# Altium schematic sheet 09_SARADC_OTP.SchDoc: =title
size A3; Organization: 六零加智能科技; Address4: www.nidone.com.cn; DocumentNumber: kang jin; Revision: 1.0; SheetNumber: 9; SheetTotal: 23
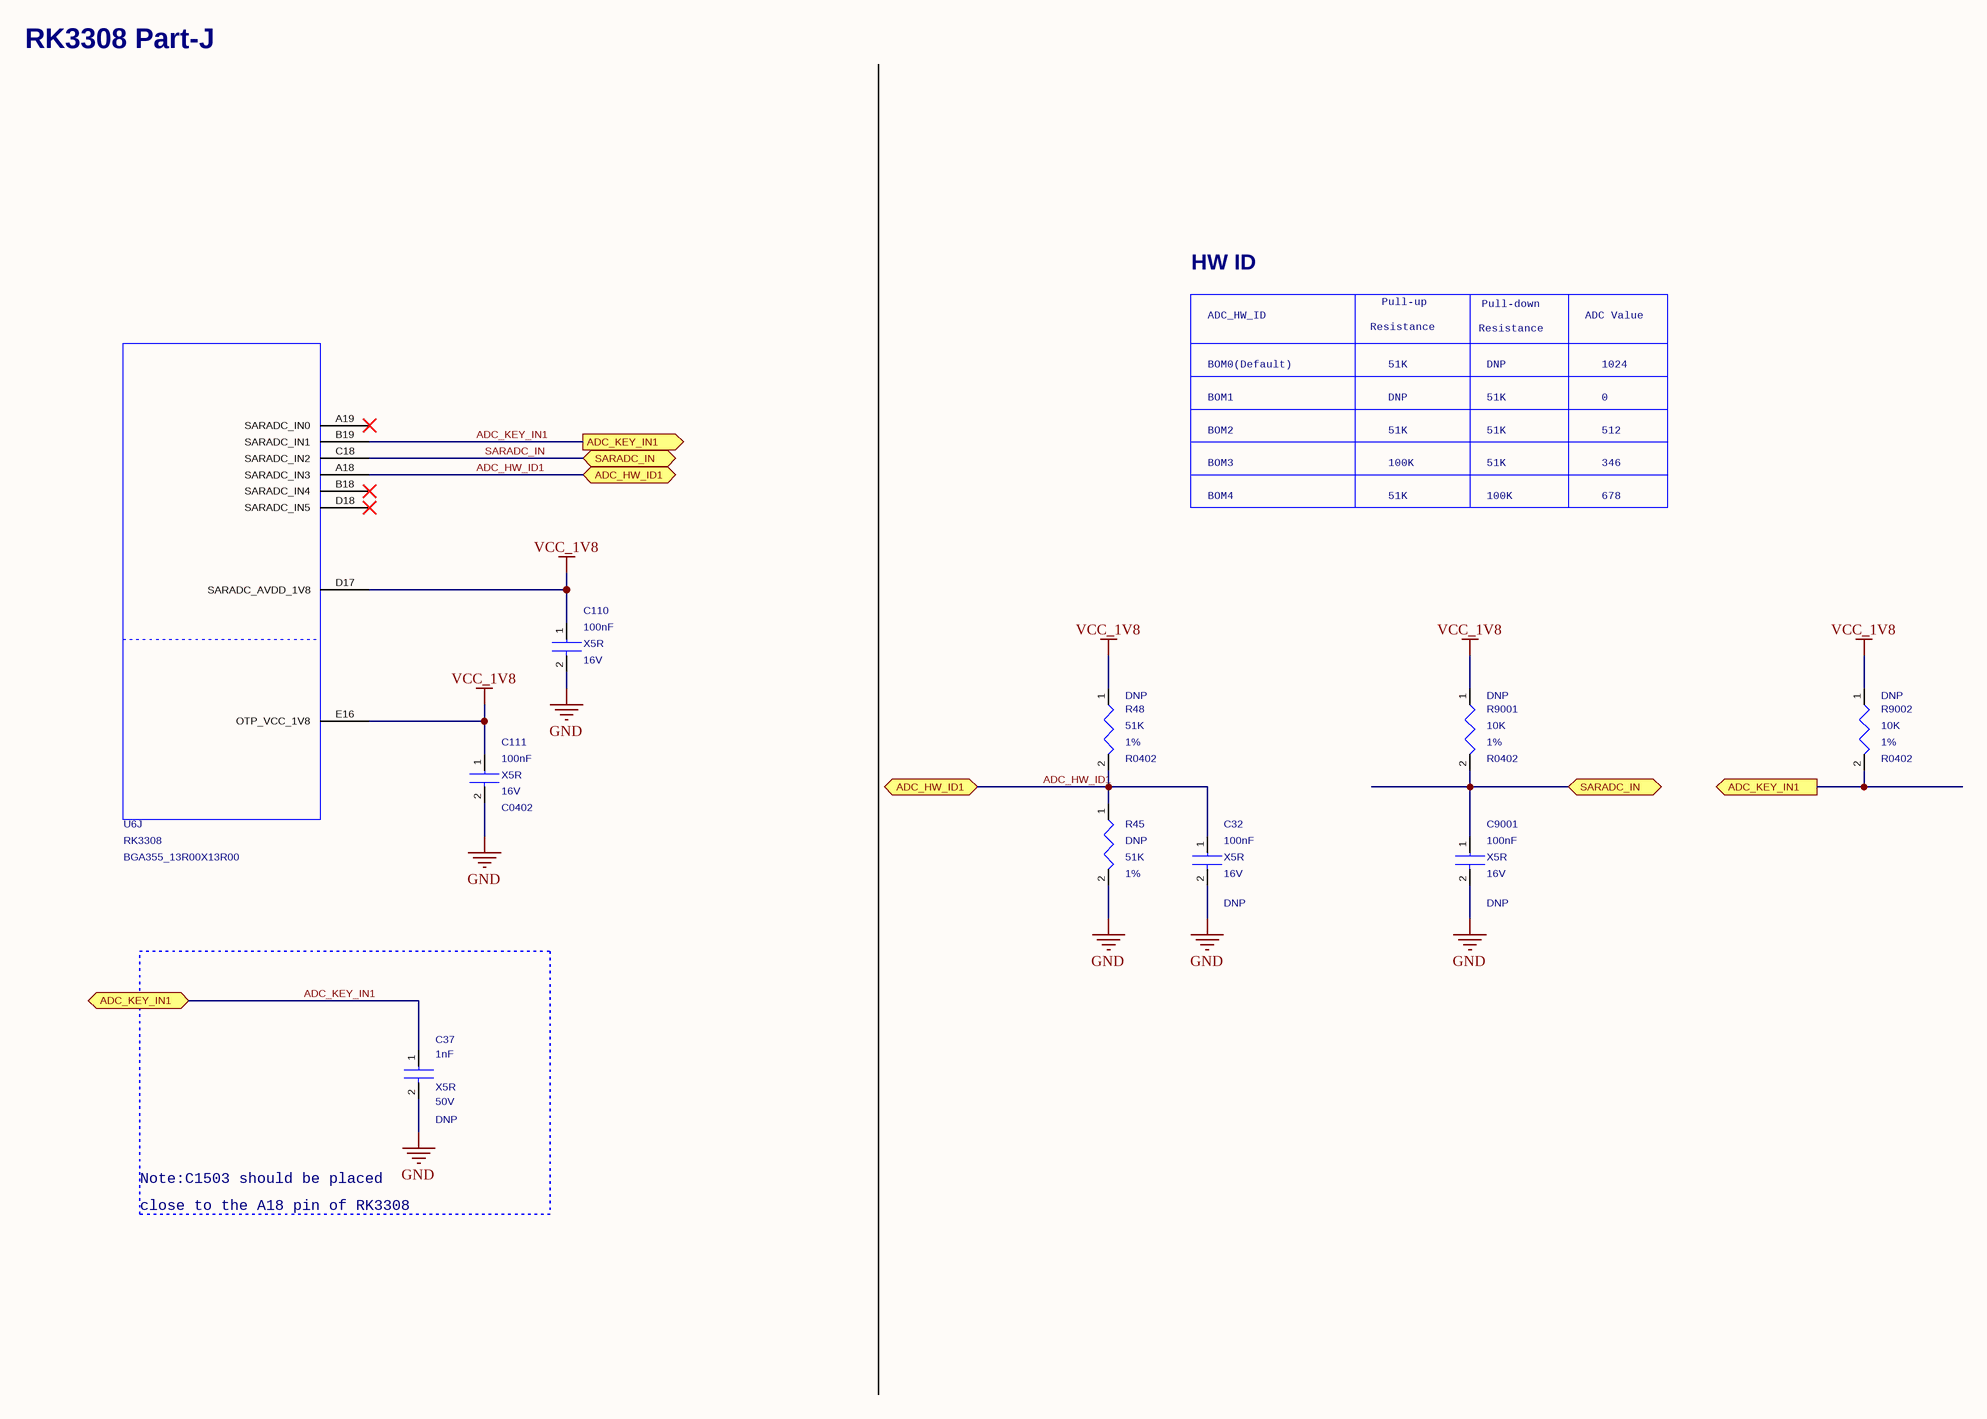
[diagram p0: 09_SARADC_OTP.SchDoc]

## Parts
C32  value 100nF  Dielectric: X5R  Voltage: 16V  Option: DNP  [C0402]  (hidden comment: CAP_NP_2)
C37  value 1nF  Dielectric: X5R  Voltage: 50V  Option: DNP  [C0402]  (hidden comment: CAP_NP_2)
C110  value 100nF  Voltage: 16V  Dielectric: X5R  [C0402]  (hidden comment: CAP_NP_2)
C111  value 100nF  Voltage: 16V  Dielectric: X5R  [C0402]  (hidden comment: CAP_NP_2)
C9001  value 100nF  Dielectric: X5R  Voltage: 16V  Option: DNP  [C0402]  (hidden comment: CAP_NP_2)
R45  value 51K  Option: DNP  Tolerance: 1%  [R0402]  (hidden comment: RESISTOR)
R48  value 51K  Tolerance: 1%  Option: DNP  [R0402]  (hidden comment: RESISTOR)
R9001  value 10K  Tolerance: 1%  Option: DNP  [R0402]  (hidden comment: RESISTOR)
R9002  value 10K  Tolerance: 1%  Option: DNP  [R0402]  (hidden comment: RESISTOR)
U6  RK3308  [BGA355_13R00X13R00]  (part J of 14)

## Ports
ADC_HW_ID1 (bidir), ADC_KEY_IN1 (bidir), ADC_KEY_IN1 (out), SARADC_IN (bidir)

## Nets
GND: C32.2 C37.2 C110.2 C111.2 C9001.2 R45.2
VCC_1V8: C110.1 C111.1 R48.1 R9001.1 R9002.1 U6.D17(SARADC_AVDD_1V8) U6.E16(OTP_VCC_1V8)
ADC_HW_ID1: C32.1 R45.1 R48.2 U6.A18(SARADC_IN3) ; port ADC_HW_ID1
ADC_KEY_IN1: C37.1 R9002.2 U6.B19(SARADC_IN1) ; port ADC_KEY_IN1
SARADC_IN: C9001.1 R9001.2 U6.C18(SARADC_IN2) ; port SARADC_IN

Not connected (* = marked no-connect by the designer): U6 A19(SARADC_IN0)* B18(SARADC_IN4)* D18(SARADC_IN5)*

## Notes on the sheet
- RK3308 Part-J
- HW ID
- ADC_HW_ID
- Resistance
- Pull-up
- Pull-down
- ADC Value
- BOM0(Default)
- BOM1
- DNP
- 51K
- 1024
- 0
- BOM2
- BOM3
- 100K
- 346
- 512
- BOM4
- 678
- Note:C1503 should be placed
- close to the A18 pin of RK3308
- Title
- Size:
- Date:
- A3
- Engineer:
- Time:
- Revision:
- Sheet
- of
- File:

## Library data of the parts
C32 C9001 = CAP_NP_2: cap,100.00nF,+/-10%,16V,X5R,C0402; Manufacturer_PN: C1005X5R1C104K050BA; Manufacturer: TDK; Created_by: JJJ; C_Voltage: 6.3V; Tolerance: 10%; Priority: A; Number: 1; Source_Path: Z:\RK_STANDARD_LIBRARY\CADENCE_CIS\RK_DISCRETE.OLB; Part_Type: C0402; RK_PN: C1005X5R1C104K050BA; PCB DECAL: C0402
C37 = CAP_NP_2: cap,1.00nF,+/-10%,50V,X5R,C0402; Manufacturer: TDK; RK_PN: C1005X5R1H102K050BA; Priority: A; Tolerance: 10%; Created_by: JJJ; Source_Path: Z:\RK_STANDARD_LIBRARY\CADENCE_CIS\RK_DISCRETE.OLB; Number: 1; Part_Type: C0402; Manufacturer_PN: C1005X5R1H102K050BA; PCB DECAL: C0402
C110 C111 = CAP_NP_2: cap,100.00nF,+/-10%,16V,X5R,C0402; Manufacturer: TDK; Number: 1; RK_PN: C1005X5R1C104K050BA; Priority: A; Tolerance: 10%; C_Voltage: 6.3V; Created_by: JJJ; Source_Path: Z:\RK_STANDARD_LIBRARY\CADENCE_CIS\RK_DISCRETE.OLB; PCB DECAL: C0402; Part_Type: C0402; Manufacturer_PN: C1005X5R1C104K050BA
R45 R48 = RESISTOR: ?用厚膜电阻,51K,+/-1%,R0402,1/16W.; Manufacturer_PN: RC0402FR-0751KL; Manufacturer: YAGEO; Created_by: YTL; Wattage: 1/16W; Priority: A; Source_Path: Z:\RK_STANDARD_LIBRARY\CADENCE_CIS\RK_DISCRETE.OLB; Part_Type: ?用厚膜电阻; RK_PN: RC0402FR-0751KL; PCB DECAL: R0402
R9001 R9002 = RESISTOR: ?用厚膜电阻,10K,+/-1%,R0402,1/16W.; Manufacturer_PN: RC0402FR-0751KL; Manufacturer: YAGEO; Created_by: YTL; Wattage: 1/16W; Priority: A; Source_Path: Z:\RK_STANDARD_LIBRARY\CADENCE_CIS\RK_DISCRETE.OLB; Part_Type: ?用厚膜电阻; RK_PN: RC0402FR-0751KL; PCB DECAL: R0402
U6 = RK3308: Manufacturer: ROCKCHIP; Source_Path: E:\SCHEMETIC\RKSCH.OLB; Number: 1; PCB DECAL: BGA355_13R00X13R00; Value: RK3308; Manufacturer_PN: RK3308